# Altium schematic sheet MicroBoard030603.SchDoc
size A3; PageSetup: Record=PageOptions|CenterHorizontal=False|CenterVertical=True|PrintScale=0.95|XCorrection=1.00|YCorrection=1.00|PrintKind=2|BorderSize=5000000|LeftOffset=0|BottomOffset=2000|Orientation=1|PaperLength=1000|PaperWidth=1000|Scale=100|PaperSource=7|PrintQuality=1200|MediaType=1|DitherType=10|PrintScaleMode=0|PaperKind=A4|PaperIndex=9
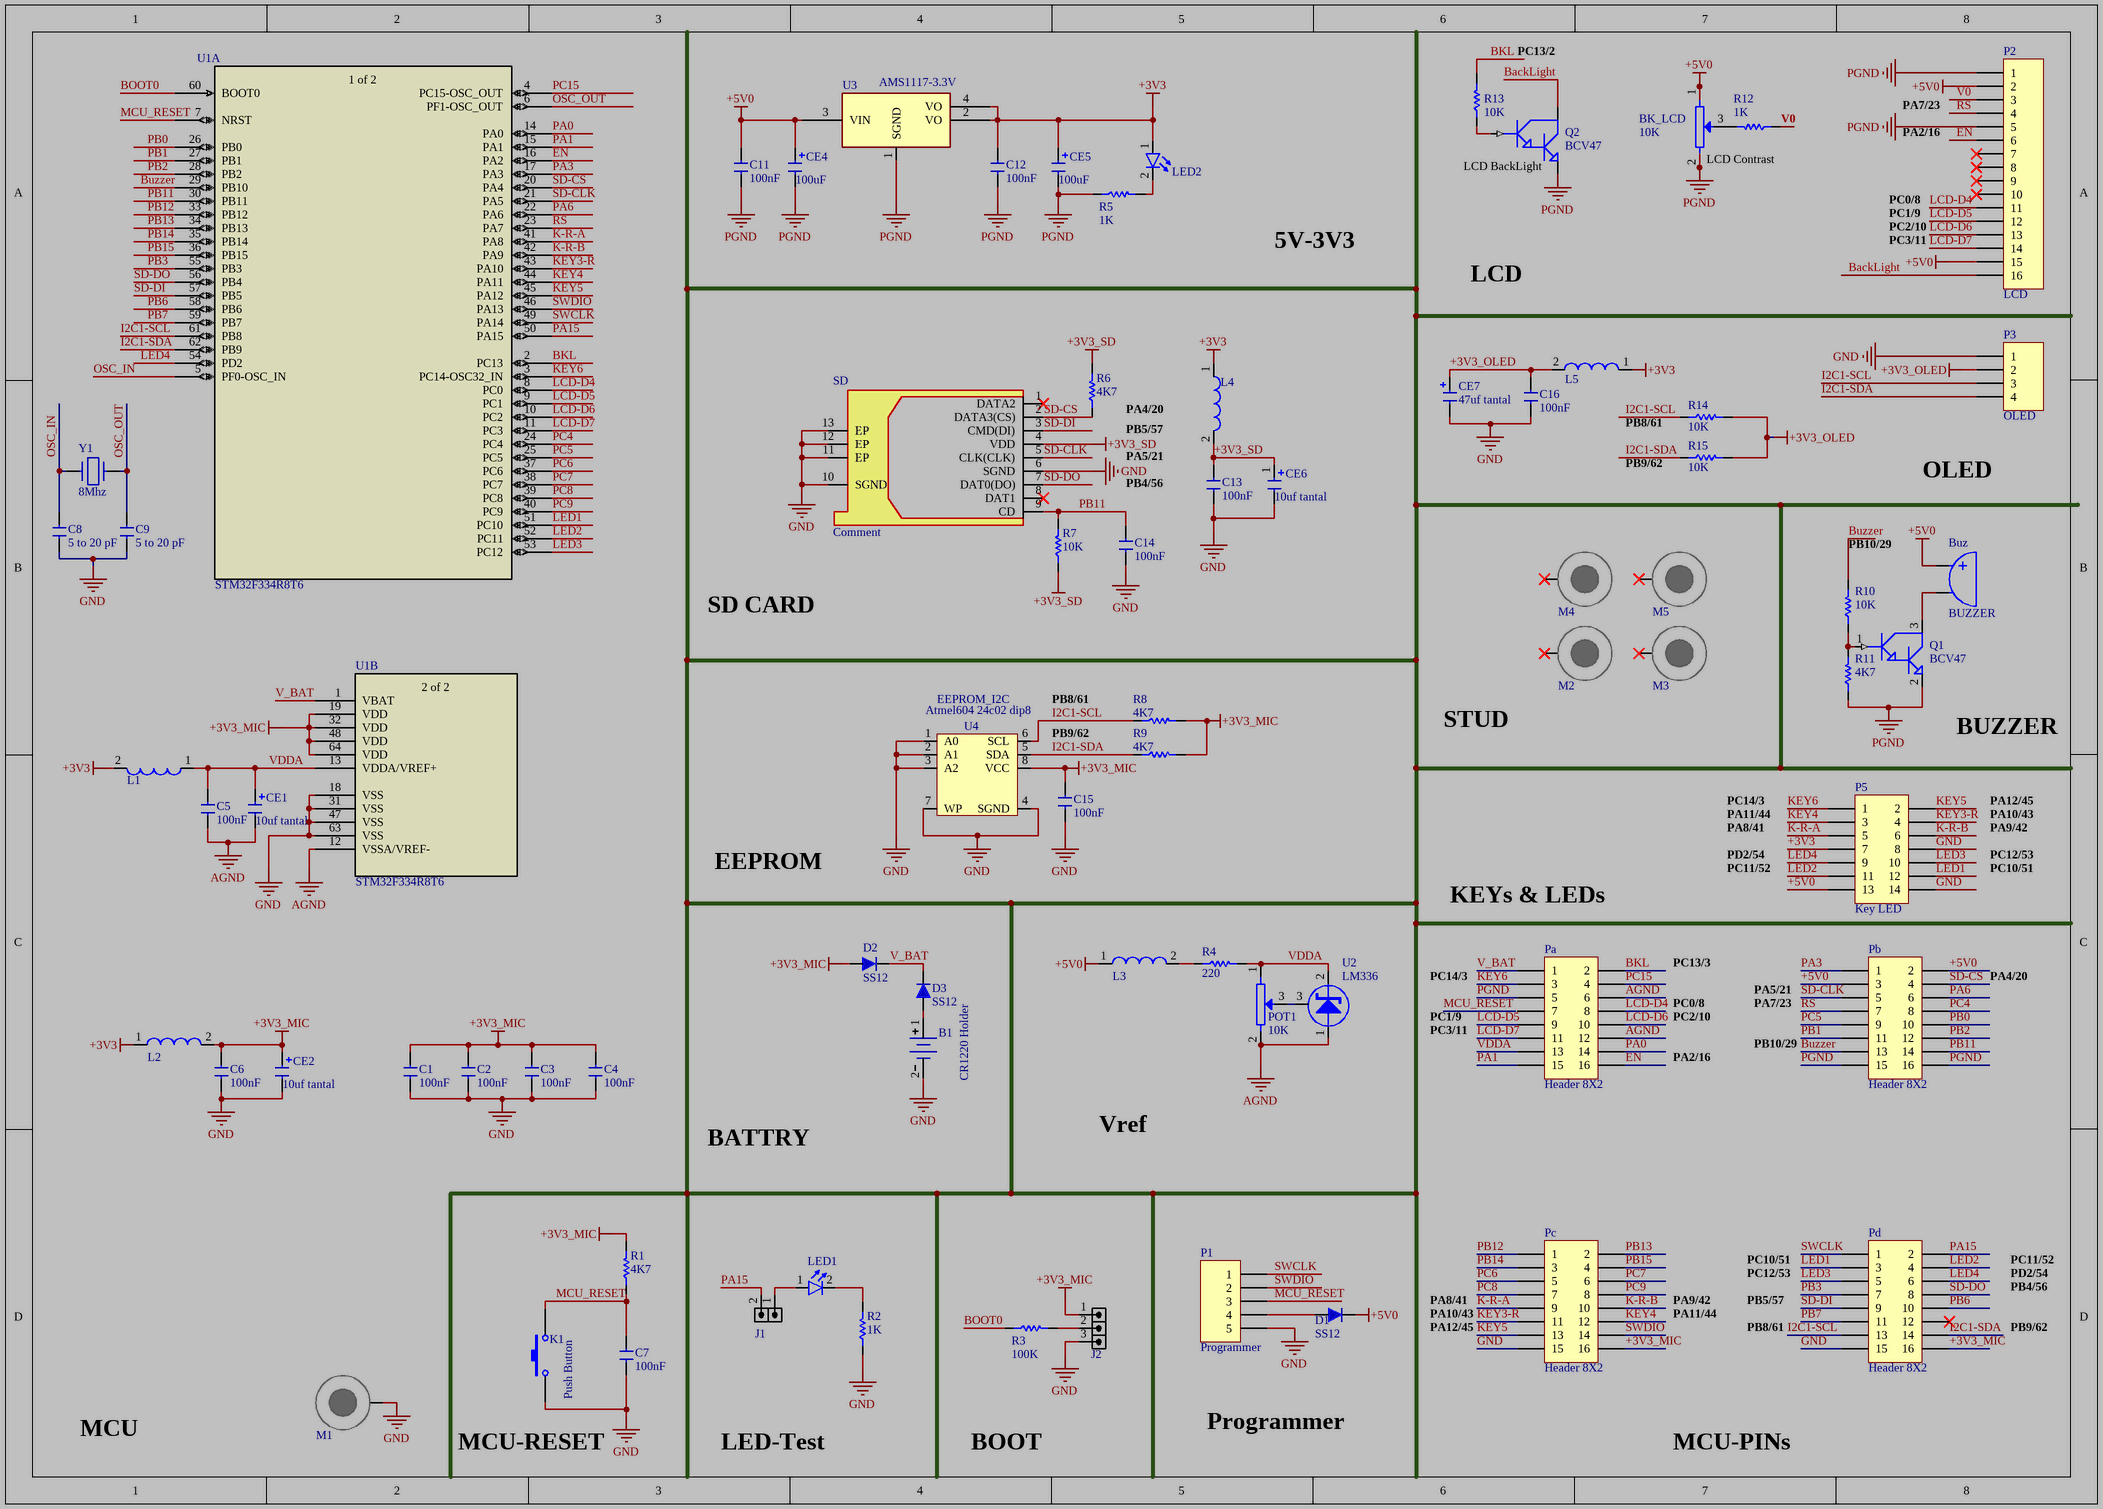
[diagram p0: MicroBoard030603.SchDoc]

## Parts
B1  CR1220 Holder  [BAT S]
BK_LCD  10K  [POT-Blue]
Buz  BUZZER  [BUZ]
C1  Comment  [SMD_CAP_1206.]  (value not drawn)
C2  Comment  [SMD_CAP_1206.]  (value not drawn)
C3  Comment  [SMD_CAP_1206.]  (value not drawn)
C4  Comment  [SMD_CAP_1206.]  (value not drawn)
C5  Comment  [SMD_CAP_1206.]  (value not drawn)
C6  Comment  [SMD_CAP_1206.]  (value not drawn)
C7  Comment  [SMD_CAP_1206.]  (value not drawn)
C8  Comment  [CAP 1206 (3216X15L)]  (value not drawn)
C9  Comment  [CAP 1206 (3216X15L)]  (value not drawn)
C11  Comment  [SMD_CAP_1206.]  (value not drawn)
C12  Comment  [SMD_CAP_1206.]  (value not drawn)
C13  Comment  [SMD_CAP_1206.]  (value not drawn)
C14  Comment  [SMD_CAP_1206.]  (value not drawn)
C15  Comment  [SMD_CAP_1206.]  (value not drawn)
C16  Comment  [SMD_CAP_1206.]  (value not drawn)
CE1  10uf tantal  [cap-e-2]
CE2  10uf tantal  [cap-e-2]
CE4  100uF  [cap-e-4]
CE5  100uF  [cap-e-4]
CE6  10uf tantal  [cap-e-2]
CE7  47uf tantal  [CAP-E-3]
D1  SS12  [Diode SMA-M]
D2  SS12  [Diode SMA-M]
D3  SS12  [Diode SMA-M]
J1  HDRM2  [HDR1X2]  (value not drawn)
J2  HDRM3  [HDR1X3]  (value not drawn)
K1  Push Button  [SW PB SMD]
L1  Comment  [INDC4532]  (value not drawn)
L2  Comment  [L RES]  (value not drawn)
L3  Comment  [L RES]  (value not drawn)
L4  Comment  [L RES]  (value not drawn)
L5  Comment  [L RES]  (value not drawn)
LED1  HB  [LED_SMD_1206]  (value not drawn)
LED2  HB  [LED_SMD_1206]  (value not drawn)
M1  Comment  [Stud-hole]  (value not drawn)  (no BOM)
M2  Comment  [Stud-hole]  (value not drawn)  (no BOM)
M3  Comment  [Stud-hole]  (value not drawn)  (no BOM)
M4  Comment  [Stud-hole]  (value not drawn)  (no BOM)
M5  Comment  [Stud-hole]  (value not drawn)  (no BOM)
P1  Programmer  [SIP 5 right]
P2  LCD  [HDR1X16]
P3  OLED  [sip 4 right]
P5  Key LED  [IDC14 r lock]
Pa  Header 8X2  [HDR2X8]
Pb  Header 8X2  [HDR2X8]
Pc  Header 8X2  [HDR2X8]
Pd  Header 8X2  [HDR2X8]
POT1  10K  [pot multi turn]
Q1  BCV47  [SOT23_M]
Q2  BCV47  [SOT23_M]
R1  4K7  [RES_1206]
R2  1K  [RES_1206]
R3  100K  [RES_1206]
R4  220  [RES_1206]
R5  1K  [RES_1206]
R6  4K7  [RES_1206]
R7  10K  [RES_1206]
R8  4K7  [RES_1206]
R9  4K7  [RES_1206]
R10  10K  [RES_1206]
R11  4K7  [RES_1206]
R12  1K  [RES_1206]
R13  10K  [RES_1206]
R14  10K  [RES_1206]
R15  10K  [RES_1206]
SD  Comment  [Micro sd csrd]
U1  STM32F334R8T6  [STM32F334R8T6]  (parts A,B of 2)
U2  LM336  [LM336]
U3  value AMS1117-3.3V  [MP04A_M]  (hidden comment: Comment)
U4  EEPROM_I2C  [dip8]
Y1  8Mhz  [Crystal SMD]

## Nets
+3V3: C12.2 CE5.1 L1.2 L2.1 L4.1 L5.1 LED2.1(A) P5.7 U3.2(VO) U3.4(VO)
+3V3_MIC: C1.2 C2.2 C3.2 C4.2 C6.2 C15.2 CE2.1 D2.1(A) J2.1 L2.2 Pc.16 Pd.16 R1.2 R8.2 R9.2 U1.19(VDD) U1.32(VDD) U1.48(VDD) U1.64(VDD) U4.8(VCC)
+3V3_OLED: C16.2 CE7.1 L5.2 P3.2 R14.2 R15.2
+3V3_SD: C13.2 CE6.1 L4.2 R6.2 R7.1 SD.4(VDD)
+5V0: BK_LCD.1 Buz.1 C11.2 CE4.1 D1.2(K) L3.1 P2.2 P2.15 P5.13 Pb.2 Pb.3 U3.3(VIN)
AGND: C5.1 CE1.2 Pa.6 Pa.12 POT1.2 U1.12(VSSA/VREF-) U2.1
GND: B1.2(-) C1.1 C2.1 C3.1 C4.1 C6.1 C7.2 C8.1 C9.2 C13.1 C14.2 C15.1 C16.1 CE2.2 CE6.2 CE7.2 J2.3 K1.1 M1.1 P1.5 P3.1 P5.8 P5.14 Pc.15 Pd.15 R2.1 SD.6(SGND) SD.10(SGND) SD.11(EP) SD.12(EP) SD.13(EP) U1.18(VSS) U1.31(VSS) U1.47(VSS) U1.63(VSS) U4.1(A0) U4.2(A1) U4.3(A2) U4.4(SGND) U4.7(WP)
PGND: BK_LCD.2 C11.1 C12.1 CE4.2 CE5.2 P2.1 P2.5 Pa.5 Pb.15 Pb.16 Q1.2(E) Q2.2(E) R5.1 R11.1 U3.1(SGND)
BackLight: P2.16 Q2.3(C)
BKL: Pa.2 R13.2 U1.2(PC13)
BOOT0: R3.1 U1.60(BOOT0)
Buzzer: Pb.13 R10.2 U1.29(PB10)
EN: P2.6 Pa.16 U1.16(PA2)
I2C1-SCL: P3.3 Pd.13 R8.1 R14.1 U1.61(PB8) U4.6(SCL)
I2C1-SDA: P3.4 Pd.14 R9.1 R15.1 U1.62(PB9) U4.5(SDA)
K-R-A: P5.5 Pc.9 U1.41(PA8)
K-R-B: P5.6 Pc.10 U1.42(PA9)
KEY3-R: P5.4 Pc.11 U1.43(PA10)
KEY4: P5.3 Pc.12 U1.44(PA11)
KEY5: P5.2 Pc.13 U1.45(PA12)
KEY6: P5.1 Pa.3 U1.3(PC14-OSC32_IN)
LCD-D4: P2.11 Pa.8 U1.8(PC0)
LCD-D5: P2.12 Pa.9 U1.9(PC1)
LCD-D6: P2.13 Pa.10 U1.10(PC2)
LCD-D7: P2.14 Pa.11 U1.11(PC3)
LED1: P5.12 Pd.3 U1.51(PC10)
LED2: P5.11 Pd.4 U1.52(PC11)
LED3: P5.10 Pd.5 U1.53(PC12)
LED4: P5.9 Pd.6 U1.54(PD2)
MCU_RESET: C7.1 K1.2 P1.3 R1.1 U1.7(NRST)
OSC_IN: C8.2 U1.5(PF0-OSC_IN) Y1.2
OSC_OUT: C9.1 U1.6(PF1-OSC_OUT) Y1.1
PA0: Pa.14 U1.14(PA0)
PA1: Pa.15 U1.15(PA1)
PA3: Pb.1 U1.17(PA3)
PA6: Pb.6 U1.22(PA6)
PA15: J1.2 Pd.2 U1.50(PA15)
PB0: Pb.10 U1.26(PB0)
PB1: Pb.11 U1.27(PB1)
PB2: Pb.12 U1.28(PB2)
PB3: Pd.7 U1.55(PB3)
PB6: Pd.10 U1.58(PB6)
PB7: Pd.11 U1.59(PB7)
PB11: C14.1 Pb.14 R7.2 SD.9(CD) U1.30(PB11)
PB12: Pc.1 U1.33(PB12)
PB13: Pc.2 U1.34(PB13)
PB14: Pc.3 U1.35(PB14)
PB15: Pc.4 U1.36(PB15)
PC4: Pb.8 U1.24(PC4)
PC5: Pb.9 U1.25(PC5)
PC6: Pc.5 U1.37(PC6)
PC7: Pc.6 U1.38(PC7)
PC8: Pc.7 U1.39(PC8)
PC9: Pc.8 U1.40(PC9)
PC15: Pa.4 U1.4(PC15-OSC_OUT)
RS: P2.4 Pb.7 U1.23(PA7)
SD-CLK: Pb.5 SD.5(CLK(CLK)) U1.21(PA5)
SD-CS: Pb.4 R6.1 SD.2(DATA3(CS)) U1.20(PA4)
SD-DI: Pd.9 SD.3(CMD(DI)) U1.57(PB5)
SD-DO: Pd.8 SD.7(DAT0(DO)) U1.56(PB4)
SWCLK: P1.1 Pd.1 U1.49(PA14)
SWDIO: P1.2 Pc.14 U1.46(PA13)
V0: P2.3 R12.1
V_BAT: D2.2(K) D3.2(K) Pa.1 U1.1(VBAT)
VDDA: C5.2 CE1.1 L1.1 Pa.13 POT1.1 R4.2 U1.13(VDDA/VREF+) U2.2
NetB1_1: B1.1(+) D3.1(A)
NetBK_LCD_3: BK_LCD.3 R12.2
NetBuz_2: Buz.2 Q1.3(C)
NetD1_1: D1.1(A) P1.4
NetJ1_1: J1.1 LED1.1(A)
NetJ2_2: J2.2 R3.2
NetL3_2: L3.2 R4.1
NetLED1_2: LED1.2(K) R2.2
NetLED2_2: LED2.2(K) R5.2
NetPOT1_3: POT1.3 U2.3
NetQ1_1: Q1.1(B) R10.1 R11.2
NetQ2_1: Q2.1(B) R13.1

Not connected (* = marked no-connect by the designer): M2 1*; M3 1*; M4 1*; M5 1*; P2 7* 8* 9* 10*; Pa 7; Pd 12*; SD 1(DATA2)* 8(DAT1)*

## Notes on the sheet
- PC13/2
- PA7/23
- (near Q2) LCD BackLight
- (near BK_LCD) LCD Contrast
- PA2/16
- PC0/8
- PC1/9
- PC2/10
- PC3/11
- 5V-3V3
- LCD
- PB5/57
- PA4/20
- PB8/61
- PB4/56
- PA5/21
- (near R15) PB9/62
- OLED
- PB10/29
- SD CARD
- (near U4) Atmel604 24c02 dip8
- PB9/62
- STUD
- BUZZER
- PD2/54
- PA8/41
- PA11/44
- PC14/3
- PC12/53
- PA9/42
- PA10/43
- PA12/45
- EEPROM
- KEYs & LEDs
- PC11/52
- PC10/51
- PC13/3
- BATTRY
- Vref
- MCU
- MCU-RESET
- LED-Test
- BOOT
- Programmer
- MCU-PINs
- (in symbol Capacitor SMD) 100nF; 5 to 20 pF
- (in symbol STM32F334R8T6, part A) 1 of 2
- (in symbol STM32F334R8T6, part B) 2 of 2

## Library data of the parts
B1 = Battry Backup
BK_LCD POT1 = POT2
C1-C9 C11-C16 = Capacitor SMD
CE1 CE2 CE4-CE7 = Capacitor Tantalium
D1-D3 = 1N4001
J1 = HDR_M_1X2: CONN, HEADER, Male, pitch: 2.54mm, 2POS; VALUE: HDRM2
J2 = HDR_M_1X3: CONN, HEADER, Male, pitch: 2.54mm, 3POS; VALUE: HDRM3
K1 = Push Kay
L1-L5 = Ferrit Bead
LED1 LED2 = LED: Designer: Saeid Jorablo; Organazation: ControTec; Adding Date: 1387/12/22; Color: HB; Size: SMD 1206
M1-M5 = SCMH_M1P6: SCREW mouting, M1.6, 1.6mm diameter and 3.2mm PanHead; VALUE: DNP/MH; ASSEMBLY: DNP
P1 = Header 5: Header, 5-Pin; LatestRevisionDate: 17-Jul-2002; LatestRevisionNote: Re-released for DXP Platform.; Publisher: Altium Limited
P2 = Header 16: Header, 16-Pin; LatestRevisionDate: 17-Jul-2002; LatestRevisionNote: Re-released for DXP Platform.; Publisher: Altium Limited
P3 = Header 4: Header, 4-Pin; LatestRevisionDate: 17-Jul-2002; LatestRevisionNote: Re-released for DXP Platform.; Publisher: Altium Limited
P5 = Header 7X2: Header, 7-Pin, Dual row; LatestRevisionDate: 17-Jul-2002; LatestRevisionNote: Re-released for DXP Platform.; Publisher: Altium Limited
Pa Pb Pc Pd = Header 8X2: Header, 8-Pin, Dual row; LatestRevisionDate: 17-Jul-2002; LatestRevisionNote: Re-released for DXP Platform.; Publisher: Altium Limited
Q1 Q2 = NPN DAR
R1-R15 = Resistor: Tolerance: 5%; Power: 1/8 W
  R1 R6 R8 R9 R11: Value: 4K7
  R2 R5 R12: Value: 1K
  R3: Value: 100K
  R4: Value: 220
  R7 R10 R13-R15: Value: 10K
SD = Micro SD Card
U1 = STM32F334R8T6: No Description Available; Mfr_Name: STMicroelectronics; Copyright: Copyright (C) 2023 Ultra Librarian. All rights reserved.; Manufacturer_Part_Number: STM32F334R8T6; RefDes: RefDes; Type: DEV
U3 = VREG_1117_SOT223: REG, Linear, LDO1V, 0.8A, SOT-223; MANF_P#: LD1117, LM1117, AMS1117, TLV1117, REG1117, NCP1117, LT1117, SPX1117; MANF: TI, ON, ST; PARAM2: 1.2/1.5/1.8/2.5/2.85/3.3/5V; PARAM: LDO1V, 0.8A
U4 = AT24C128
Y1 = Xtal